# EAGLE design reefingBrd (EAGLE 9.6.2)
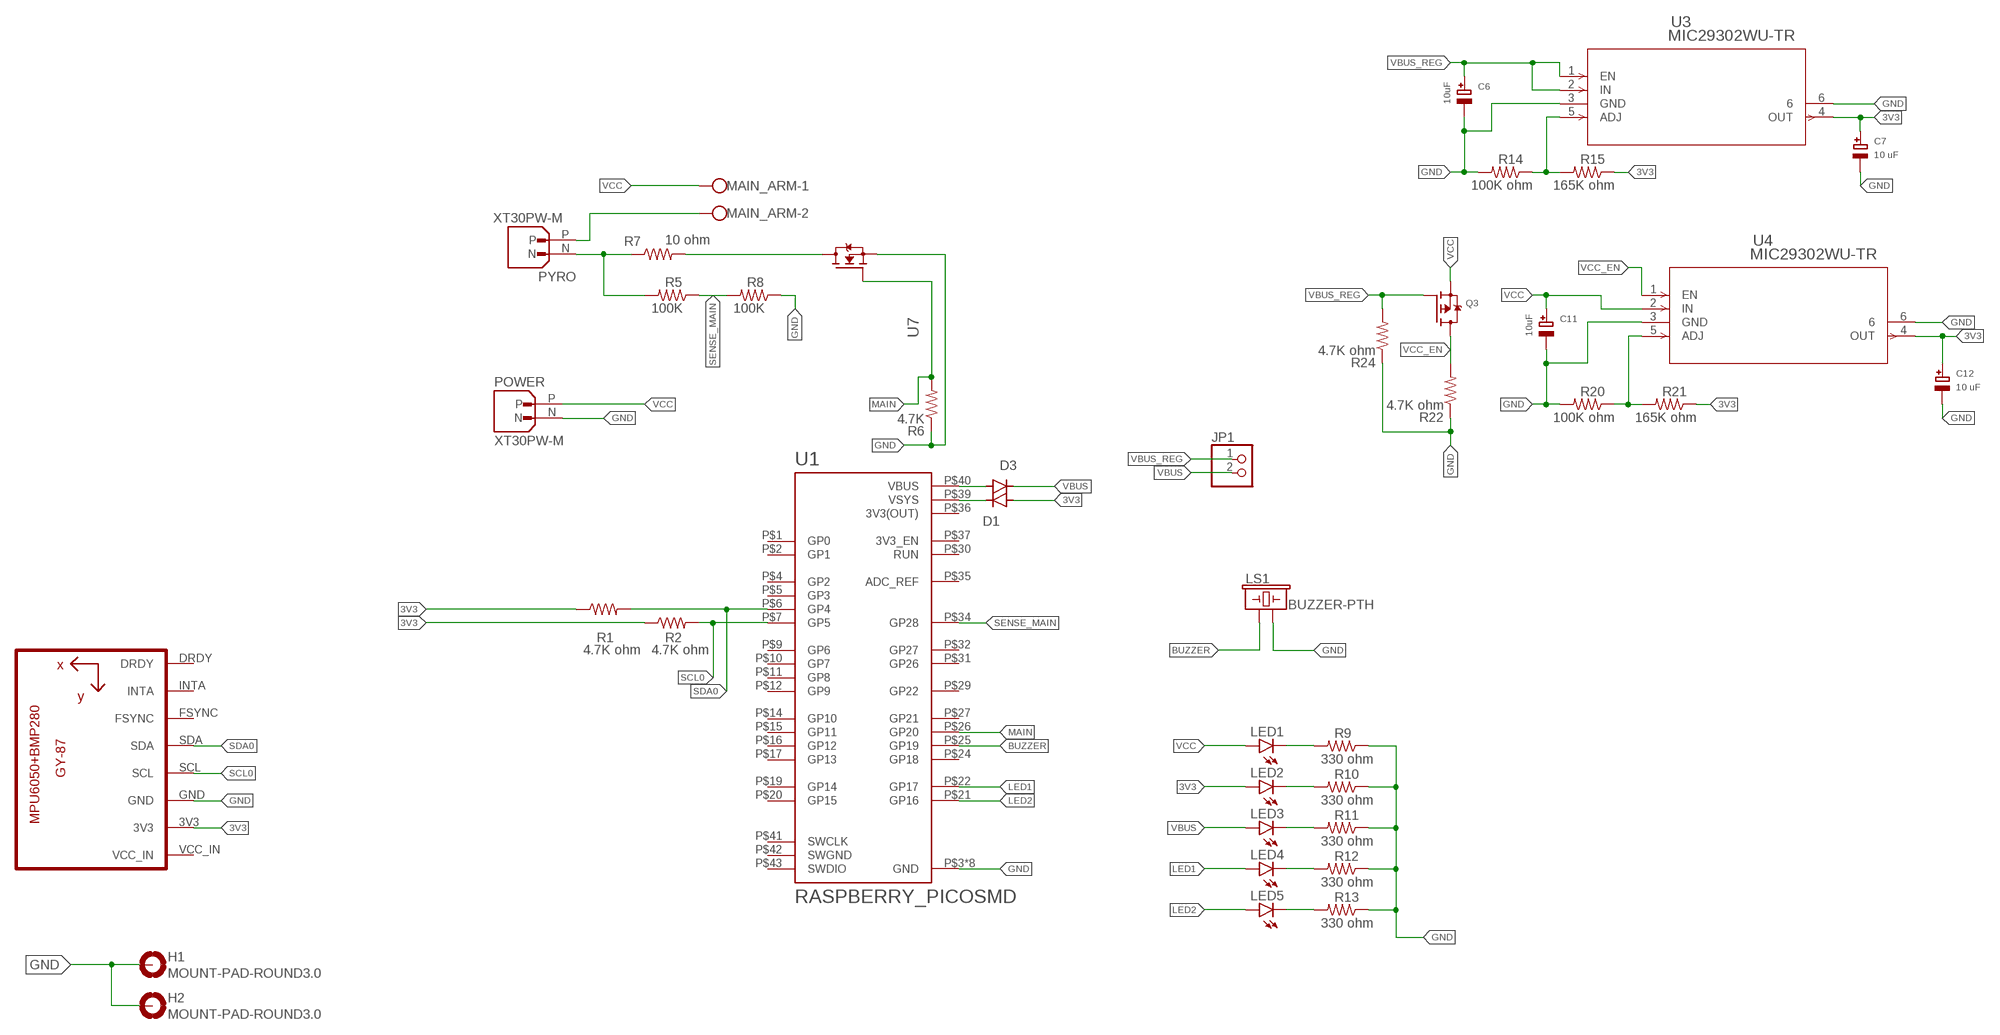
[diagram p0: schematic, sheet 1]

## Parts
C6  10uF  CAP_TANTALUMA/3216_WAVE  [EIA3216-18/A-W]
C7  10 uF  CAP_TANTALUMA/3216_WAVE  [EIA3216-18/A-W]
C11  10uF  CAP_TANTALUMA/3216_WAVE  [EIA3216-18/A-W]
C12  10 uF  CAP_TANTALUMA/3216_WAVE  [EIA3216-18/A-W]
D1  1N4004  [DO41-10]
D3  1N4004  [DO41-10]
H1  MOUNT-PAD-ROUND3.0  [3,0-PAD]
H2  MOUNT-PAD-ROUND3.0  [3,0-PAD]
JP1  PINHD-1X2  [1X02]
LED1  LEDCHIPLED_1206  [CHIPLED_1206]
LED2  LEDCHIPLED_1206  [CHIPLED_1206]
LED3  LEDCHIPLED_1206  [CHIPLED_1206]
LED4  LEDCHIPLED_1206  [CHIPLED_1206]
LED5  LEDCHIPLED_1206  [CHIPLED_1206]
LS1  BUZZER-PTH  [BUZZER-12MM]
MAIN_ARM  W237-102  [W237-102]
POWER  XT30PW-M  [AMASS_XT30PW-M]
PYRO  XT30PW-M  [AMASS_XT30PW-M]
Q3  MOSFET-PWIDE  [SOT23-WIDE]
R1  4.7K ohm  R-US_R0805  [R0805]
R2  4.7K ohm  R-US_R0805  [R0805]
R5  100K  R-US_R0805  [R0805]
R6  4.7K  R-US_R0805  [R0805]
R7  10 ohm  R-US_0207/10  [0207/10]
R8  100K  R-US_R0805  [R0805]
R9  330 ohm  R-US_R0805  [R0805]
R10  330 ohm  R-US_R0805  [R0805]
R11  330 ohm  R-US_R0805  [R0805]
R12  330 ohm  R-US_R0805  [R0805]
R13  330 ohm  R-US_R0805  [R0805]
R14  100K ohm  R-US_R0805  [R0805]
R15  165K ohm  R-US_R0805  [R0805]
R20  100K ohm  R-US_R0805  [R0805]
R21  165K ohm  R-US_R0805  [R0805]
R22  4.7K ohm  R-US_R0805  [R0805]
R24  4.7K ohm  R-US_R0805  [R0805]
U1  RASPBERRY_PICOSMD  [PICO-PKG-SMD]
U2  GY-521MPU6050  [GY-521]
U3  MIC29302WU-TR  [TO-263-5_MCH]
U4  MIC29302WU-TR  [TO-263-5_MCH]
U7  IRF540NPBF  [TO254P1054X469X1930-3]

## Nets
3V3: C7.+ C12.+ D1.A LED2.A R1.1 R2.1 R15.1 R21.1 U2.3V3 U3.4(OUT) U4.4(OUT)
BUZZER: LS1.+ U1.P$25(GP19)
GND: C6.- C7.- C11.- C12.- H1.B3,0(MOUNT) H2.B3,0(MOUNT) LS1.- POWER.N R6.1 R8.1 R9.1 R10.1 R11.1 R12.1 R13.1 R14.2 R20.2 R22.1 R24.1 U1.P$3(GND) U1.P$8(GND) U1.P$13(GND) U1.P$18(GND) U1.P$23(GND) U1.P$28(GND) U1.P$33(GND) U1.P$38(GND) U2.GND U3.3(GND) U3.6 U4.3(GND) U4.6 U7.3(S)
LED1: LED4.A U1.P$22(GP17)
LED2: LED5.A U1.P$21(GP16)
MAIN: R6.2 U1.P$26(GP20) U7.1(G)
N$1: D1.C U1.P$39(VSYS)
N$2: D3.A U1.P$40(VBUS)
N$3: R20.1 R21.2 U4.5(ADJ)
N$4: PYRO.N R5.2 R7.1
N$5: R7.2 U7.2(D)
N$6: MAIN_ARM.2 PYRO.P
N$10: R14.1 R15.2 U3.5(ADJ)
N$11: LED1.C R9.2
N$12: LED2.C R10.2
N$13: LED3.C R11.2
N$14: LED4.C R12.2
N$15: LED5.C R13.2
SCL0: R2.2 U1.P$7(GP5) U2.SCL
SDA0: R1.2 U1.P$6(GP4) U2.SDA
SENSE_MAIN: R5.1 R8.2 U1.P$34(GP28)
VBUS: D3.C JP1.2 LED3.A
VBUS_REG: C6.+ JP1.1 Q3.1(G) R24.2 U3.1(EN) U3.2(IN)
VCC: C11.+ LED1.A MAIN_ARM.1 POWER.P Q3.2(S) U4.2(IN)
VCC_EN: Q3.3(D) R22.2 U4.1(EN)
Unconnected: U1.P$1(GP0) U1.P$2(GP1) U1.P$4(GP2) U1.P$5(GP3) U1.P$9(GP6) U1.P$10(GP7) U1.P$11(GP8) U1.P$12(GP9) U1.P$14(GP10) U1.P$15(GP11) U1.P$16(GP12) U1.P$17(GP13) U1.P$19(GP14) U1.P$20(GP15) U1.P$24(GP18) U1.P$27(GP21) U1.P$29(GP22) U1.P$30(RUN) U1.P$31(GP26) U1.P$32(GP27) U1.P$35(ADC_REF) U1.P$37(3V3_EN) U1.P$41(SWCLK) U1.P$43(SWDIO) U2.DRDY U2.FSYNC U2.INTA U2.VCC_IN

## Power pins joined to a net without a drawn wire
3V3(OUT): U1.P$36(3V3(OUT))
SWGND: U1.P$42(SWGND)

## Library data of the parts
C6 C7 C11 C12 = microbuilder:CAP_TANTALUM: Tantalum Capacitors Wave footprints have larger pads and are meant to be used for hand soldering. Reflow footprints are optimised for solder paste and a reflow oven. EIA3216-18/A-[R/W] - Size A / 3216-18 / 1206 footprint 4.7µF 25V 10% Tantalum Capacitor 10µF 16V 10% Tantalum Capacitor [Digikey: 495-2236-2-ND] EIA3528-21/B-[R/W] - Size B / 3528-21 47µF 10V 10% Tantalum Capactior [Digikey: 495-2216-1-ND] EIA6032-28/C-[R/W] - Size C / 6032-28 10µF 35V 20% Tantalum Capacitor [Digikey: 495-2285-1-ND] 100µF 16V 10% Tantalum Capactior [Digikey: 399-5214-1-ND]
D1 D3 = diode:1N4004: DIODE general purpose rectifier, 1 A
H1 H2 = holes:MOUNT-PAD-ROUND: MOUNTING PAD, round
JP1 = pinhead:PINHD-1X2: PIN HEADER
LED1-LED5 = led:LED: LED OSRAM: - CHIPLED LG R971, LG N971, LY N971, LG Q971, LY Q971, LO R971, LY R971 LH N974, LH R974 LS Q976, LO Q976, LY Q976 LO Q996 - Hyper CHIPLED LW Q18S LB Q993, LB Q99A, LB R99A - SideLED LS A670, LO A670, LY A670, LG A670, LP A670 LB A673, LV A673, LT A673, LW A673 LH A674 LY A675 LS A676, LA A676, LO A676, LY A676, LW A676 LS A679, LY A679, LG A679 - Hyper Micro SIDELED® LS Y876, LA Y876, LO Y876, LY Y876 LT Y87S - SmartLED LW L88C, LW L88S LB L89C, LB L89S, LG L890 LS L89K, LO L89K, LY L89K LS L896, LA L896, LO L896, LY L896 - TOPLED LS T670, LO T670, LY T670, LG T670, LP T670 LSG T670, LSP T670, LSY T670, LOP T670, LYG T670 LG T671, LOG T671, LSG T671 LB T673, LV T673, LT T673, LW T673 LH T674 LS T676, LA T676, LO T676, LY T676, LB T676, LH T676, LSB T676, LW T676 LB T67C, LV T67C, LT T67C, LS T67K, LO T67K, LY T67K, LW E67C LS E67B, LA E67B, LO E67B, LY E67B, LB E67C, LV E67C, LT E67C LW T67C LS T679, LY T679, LG T679 LS T770, LO T770, LY T770, LG T770, LP T770 LB T773, LV T773, LT T773, LW T773 LH T774 LS E675, LA E675, LY E675, LS T675 LS T776, LA T776, LO T776, LY T776, LB T776 LHGB T686 LT T68C, LB T68C - Hyper Mini TOPLED® LB M676 - Mini TOPLED Santana® LG M470 LS M47K, LO M47K, LY M47K Source: http://www.osram.convergy.de LUXEON: - LUMILED® LXK2-PW12-R00, LXK2-PW12-S00, LXK2-PW14-U00, LXK2-PW14-V00 LXK2-PM12-R00, LXK2-PM12-S00, LXK2-PM14-U00 LXK2-PE12-Q00, LXK2-PE12-R00, LXK2-PE12-S00, LXK2-PE14-T00, LXK2-PE14-U00 LXK2-PB12-K00, LXK2-PB12-L00, LXK2-PB12-M00, LXK2-PB14-N00, LXK2-PB14-P00, LXK2-PB14-Q00 LXK2-PR12-L00, LXK2-PR12-M00, LXK2-PR14-Q00, LXK2-PR14-R00 LXK2-PD12-Q00, LXK2-PD12-R00, LXK2-PD12-S00 LXK2-PH12-R00, LXK2-PH12-S00 LXK2-PL12-P00, LXK2-PL12-Q00, LXK2-PL12-R00 Source: www.luxeon.com KINGBRIGHT: KA-3528ASYC Source: www.kingbright.com
LS1 = SparkFun-Electromechanical:BUZZER: Buzzer Small round buzzers that operate around the audible 2kHz range. You can use these as speakers to create simple music or user interfaces. Variant Overview: PTH - Mini Speaker - PC Mount 12mm 2.048kHz <https://www.sparkfun.com/products/7950> PTH_KIT - Mini Speaker - PC Mount 12mm 2.048kHz <https://www.sparkfun.com/products/7950> KIT simplifies soldering by adding stop mask to one side of the pads. PTH_NO_SILK - Mini Speaker - PC Mount 12mm 2.048kHz <https://www.sparkfun.com/products/7950> No silkscreen indicator of buzzer outline. PTH_KIT_NO_SILK - Mini Speaker - PC Mount 12mm 2.048kHz <https://www.sparkfun.com/products/7950> KIT package w/o silkscreen SMD - Buzzer Audio Magnetic (CCV-084B16) SMD buzzer used on, e.g. the LilyPad Buzzer <https://www.sparkfun.com/products/8463> and RFID USB Reader <https://www.sparkfun.com/products/9963>. SMD_KIT - Buzzer Audio Magnetic (CCV-084B16) SMD Buzzer with elongated pins to make soldering easier. Used on the SparkFun Simon Says - Surface Mount Soldering Kit <https://www.sparkfun.com/products/10935>. SMD-SQUARE - Buzzer Audio Magnetic (COMP-15701) SMT square buzzer with one chamfered corner.; PROD_ID: COMP-08253; SF_SKU: COM-07950
MAIN_ARM = con-wago-500:W237-102: WAGO SCREW CLAMP; MPN: 237-102; OC_FARNELL: unknown; OC_NEWARK: 70K9898
POWER PYRO = XT30PW-M:XT30PW-M: Check availability <https://pricing.snapeda.com/parts/XT30PW-M/AMASS/view-part?ref=eda>; AVAILABILITY: Not in stock; CHECK_PRICES: https://www.snapeda.com/parts/XT30PW-M/AMASS/view-part/?ref=eda; DESCRIPTION: Socket; DC supply; XT30; male; PIN: 2; on PCBs; THT; Colour: yellow; MF: AMASS; MP: XT30PW-M; PACKAGE: None; PRICE: None; SNAPEDA_LINK: https://www.snapeda.com/parts/XT30PW-M/AMASS/view-part/?ref=snap
Q3 = microbuilder:MOSFET-P: P-Channel Mosfet LEGEND VDS: Voltage Drain-Source ID: Drain Current RDS(ON): Drain-Source On-State Resistance VGS(TH): Gate-Source Threshold Voltage CISS: Drain-Source Input Capacitance SOT-23 Name VDS ID RDS(ON) VGS(TH) CISS Order Number IRLML5103 30V 760mA 600 mOhm -- 75pF @ 25V Digikey: IRLML5103PBFCT-ND IRLML6401 12V 4.3A 50 mOhm 950mV @ 250µA 830pF @ 10V Digikey: IRLML6401PBFTR-ND NTR0202PL 20V 400mA 800 mOhm 2.3V @ 250uA 70pF @ 5V Digikey: NTR0202PLT1GOSTR-ND NTR4101PT1G 20V 1.8A 85 mOhm 1.2V @ 250uA 675pF @ 10V Digikey: NTR4101PT1GOSCT-ND DMP2004K 20V 600mA 900 mOhm 1V @ 250uA 175pF @ 16V Digikey: DMP2004KDICT-ND PMV65XP 20V 3.9A 76 mOhm 950mV @ 1mA 725pF @ 20V Digikey: 568-2358-2-ND TO-252 Name VDS ID RDS(ON) VGS(TH) CISS Order Number AOD417 30V 25A 34 mOhm 3V @ 250µA 920pF @ 15V Digikey: 785-1106-2-ND
R1 R2 R5-R15 R20-R22 R24 = rcl:R-US_: RESISTOR, American symbol; SPICEPREFIX: R
U1 = RpiPico:RASPBERRY_PICO: Raspberry Pi Pico
U2 = gy-87:GY-521
U3 U4 = MIC29302WU:MIC29302WU-TR; COPYRIGHT: Copyright (C) 2024 Ultra Librarian. All rights reserved.; MANUFACTURER_PART_NUMBER: MIC29302WU-TR; MFR_NAME: Microchip
U7 = IRF540NPBF:IRF540NPBF: Check availability <https://pricing.snapeda.com/parts/IRF540NPBF/Infineon/view-part?ref=eda>; AVAILABILITY: In Stock; DESCRIPTION: RoHS Compliant | Low RDS(on) | Industry-leading quality | Dynamic dv/dt Rating | Fast Switching | Fully Avalanche Rated | 175C Operating Temperature; MF: Infineon; MP: IRF540NPBF; PACKAGE: TO-220 Infineon; PRICE: None; PURCHASE-URL: https://pricing.snapeda.com/search/part/IRF540NPBF/?ref=eda

## Board
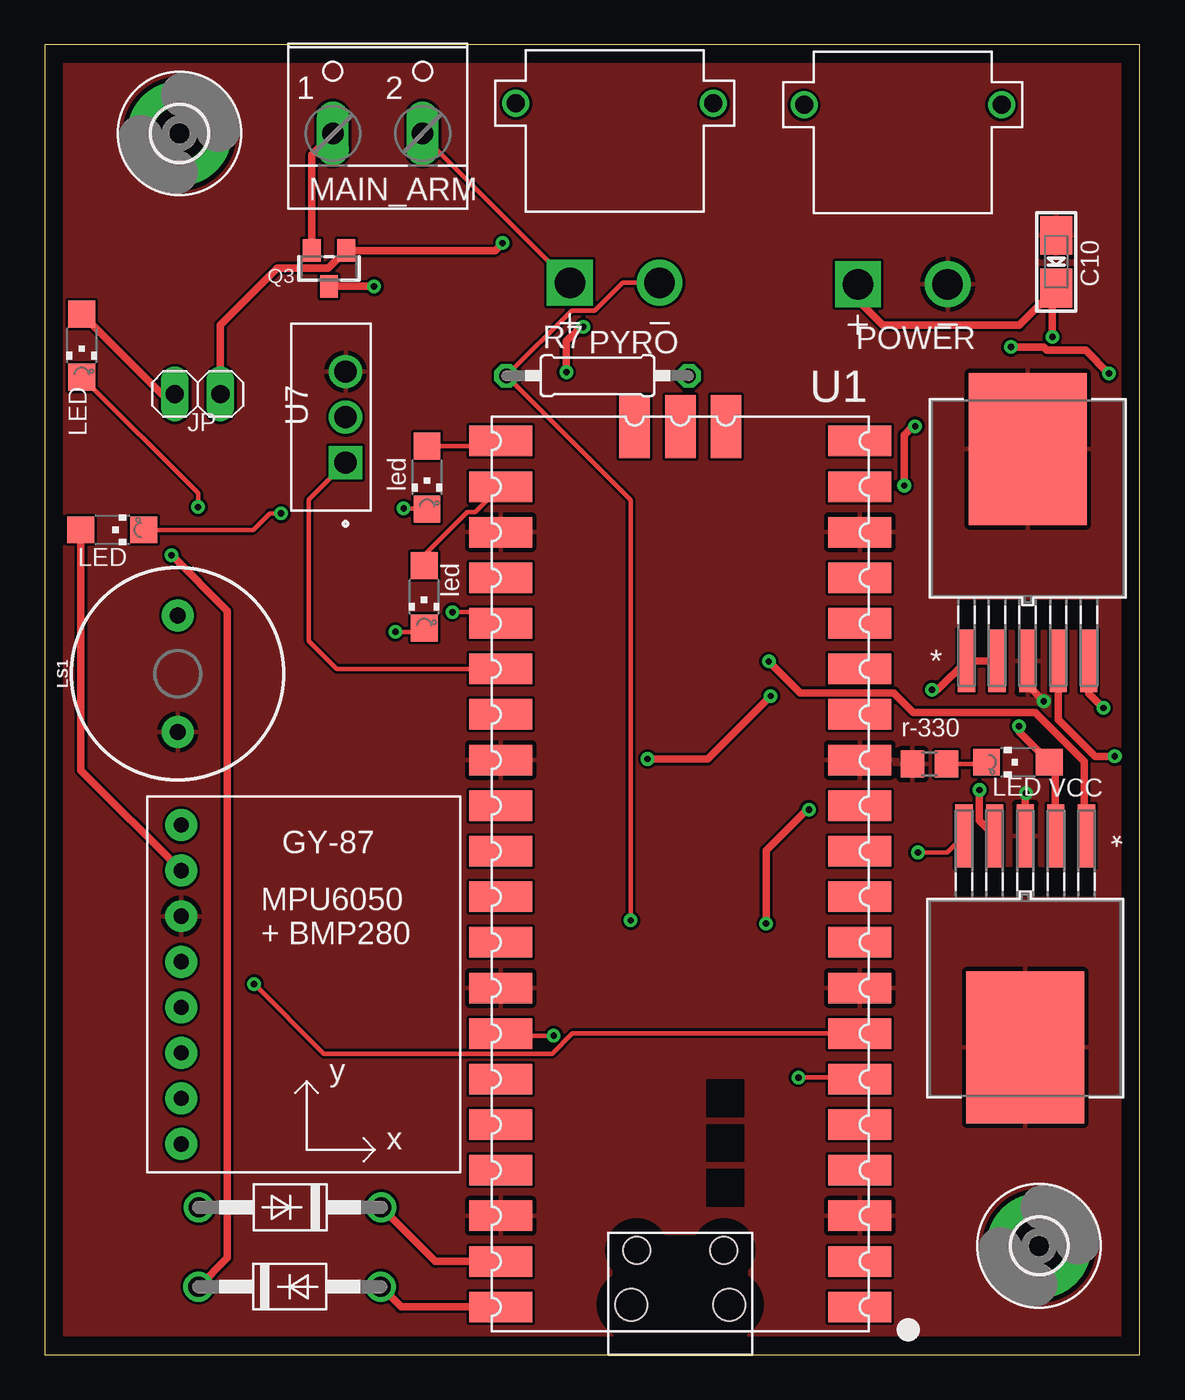
[diagram p1: board, top side]
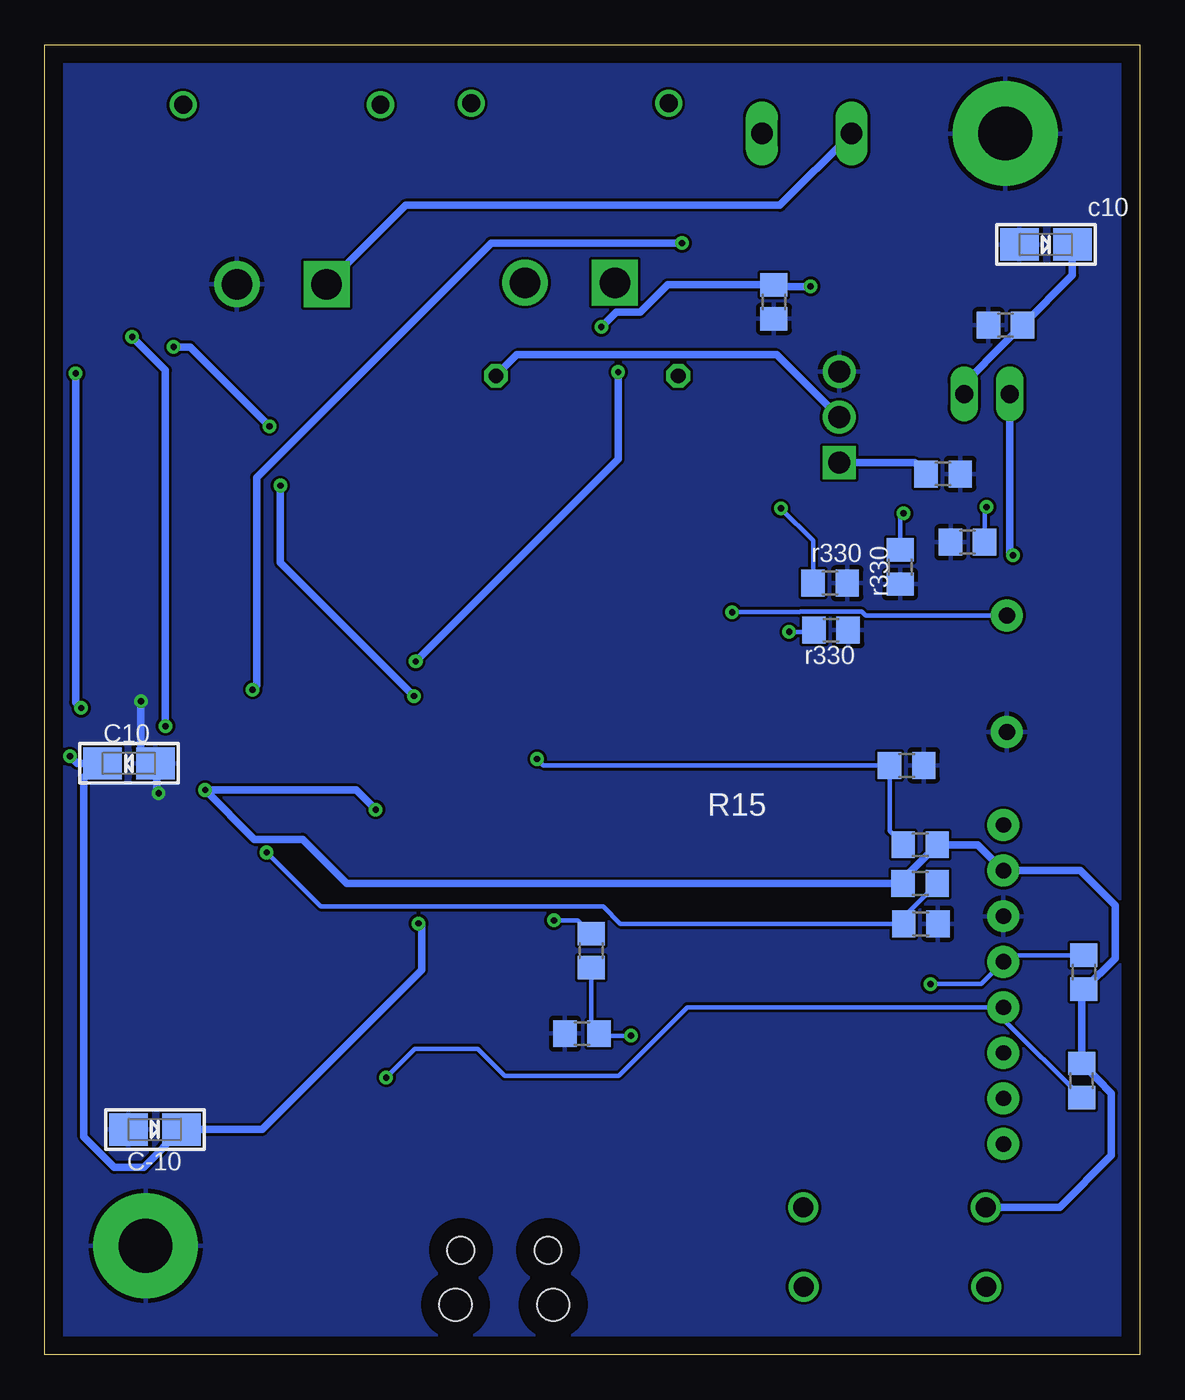
[diagram p2: board, bottom side, seen from below]

Size 61 x 73 mm. Coordinates in mm from the lower left corner, seen from the top.
Outline: 0,0 61,0 61,73 0,73 0,0
Copper layers (1*16): Top 0.035mm / dielectric 1.5mm / Bottom 0.035mm
Design rules "default": minimum track width 6mil, minimum drill 0.35mm, track to track 6mil, track to pad 6mil, pad to pad 6mil, via to via 6mil, smd to smd 6mil, copper to edge 40mil, drill to drill 6mil, minimum pad ring 10mil, minimum via ring 8mil, stop-mask expansion 4mil, vias tented up to drill 0mil, thermal gap 10mil

### Footprints (pad centres in the part's own frame; a part is rotated, then mirrored left to right if it is on the bottom)
EIA3216-18/A-W = smd 2.15 x 1.8: + 1.475,0; - -1.475,0
DO41-10 = drill 1.118: A 5.08,0; C -5.08,0
3,0-PAD = drill 3 pad 5.842: B3,0 0,0
1X02 = drill 1.016 long: 1 -1.27,0; 2 1.27,0
CHIPLED_1206 = smd 1.5 x 1.5: A 0,-1.75; C 0,1.75
BUZZER-12MM = drill 0.9 pad 1.778: + 3.25,0; - -3.25,0
W237-102 = drill 1.194 long: 1 -2.5,-1.27; 2 2.5,-1.27
AMASS_XT30PW-M = drill 1.7: N 2.5,-10 | drill 1.7 square: P -2.5,-10 | drill 1: S1 5.5,0; S2 -5.5,0
SOT23-WIDE = smd 1 x 1.27: 1 -0.95,-1; 2 0.95,-1; 3 0,1
R0805 = smd 1.3 x 1.5: 1 -0.95,0; 2 0.95,0
0207/10 = drill 0.813 octagon: 1 -5.08,0; 2 5.08,0
PICO-PKG-SMD = smd 3.5 x 1.7: P$1 -10,24.13; P$2 -10,21.59; P$3 -10,19.05; P$4 -10,16.51; P$5 -10,13.97; P$6 -10,11.43; P$7 -10,8.89; P$8 -10,6.35; P$9 -10,3.81; P$10 -10,1.27; P$11 -10,-1.27; P$12 -10,-3.81; P$13 -10,-6.35; P$14 -10,-8.89; P$15 -10,-11.43; P$16 -10,-13.97; P$17 -10,-16.51; P$18 -10,-19.05; P$19 -10,-21.59; P$20 -10,-24.13; P$21 10,-24.13; P$22 10,-21.59; P$23 10,-19.05; P$24 10,-16.51; P$25 10,-13.97; P$26 10,-11.43; P$27 10,-8.89; P$28 10,-6.35; P$29 10,-3.81; P$30 10,-1.27; P$31 10,1.27; P$32 10,3.81; P$33 10,6.35; P$34 10,8.89; P$35 10,11.43; P$36 10,13.97; P$37 10,16.51; P$38 10,19.05; P$39 10,21.59; P$40 10,24.13 | smd 1.7 x 3.5: P$41 -2.54,-24.925; P$42 0,-24.925; P$43 2.54,-24.925 | hole 1.8: -2.725,24; 2.725,24 | hole 1.5: -2.425,20.97; 2.425,20.97
GY-521 = drill 0.85 pad 1.778: 3V3 1.905,16.828; DRDY 1.905,1.587; FSYNC 1.905,6.668; GND 1.905,14.287; INTA 1.905,4.128; SCL 1.905,11.748; SDA 1.905,9.207; VCC_IN 1.905,19.367
TO-263-5_MCH = smd 0.965 x 3.505: 1 -3.404,-9.055; 2 -1.702,-9.055; 3 0,-9.055; 4 1.702,-9.055; 5 3.404,-9.055 | smd 6.553 x 8.458: 6 0,2.743
TO254P1054X469X1930-3 = drill 1.23 square: 1 -2.54,-0.81 | drill 1.23: 2 0,-0.81; 3 2.54,-0.81

### Placement (x,y rotation side)
C6  5.23,61.87 0 bottom
C7  54.87,12.55 0 bottom
C11  56.35,60.91 270 top
C12  56.32,32.95 180 bottom
D1  13.66,8.21 180 top
D3  13.64,3.79 0 top
H1  55.39,6.06 0 top
H2  7.5,68.06 0 top
JP1  8.51,53.54 180 top
LED1  54.21,33.02 90 top
LED2  3.76,45.97 270 top
LED3  2.05,56.24 180 top
LED4  21.13,42.24 180 top
LED5  21.29,48.89 180 top
LS1  7.4,37.95 90 top
MAIN_ARM  18.55,69.33 0 top
POWER  47.8,69.66 0 top
PYRO  31.75,69.75 0 top
Q3  15.83,60.54 180 top
R1  3.24,15.28 270 bottom
R2  3.11,21.31 90 bottom
R5  30.56,22.52 90 bottom
R6  10.95,49.09 180 bottom
R7  30.79,54.55 0 top
R8  31.07,17.89 0 bottom
R9  49.29,32.92 0 top
R10  13.35,43.9 90 bottom
R11  9.59,45.28 0 bottom
R12  17.2,40.38 180 bottom
R13  17.25,43 180 bottom
R14  12.99,32.84 0 bottom
R15  12.23,28.42 180 bottom
R20  12.2,24.01 0 bottom
R21  12.23,26.27 0 bottom
R22  20.38,58.68 90 bottom
R24  7.48,57.38 0 bottom
U1  35.4,26.79 180 top
U2  5.69,10.15 0 top
U3  54.76,47.73 0 top
U4  54.62,19.86 180 top
U7  15.94,52.25 90 top

### Tracks (layer width: path | path; a pad name or v marks a point on that pad's centre or on a via)
3V3  (via drill 0.35)
  Top 0.406: v59.61,33.35 58.51,33.35 56.46,35.4 U3.4 | LED2.A 2.01,32.56 U2.3V3 | U4.4 52.07,29.77 v52.07,31.47 | v40.18,24.03 40.18,28.09 42.47,30.38 v42.57,30.38
  Bottom 0.406: C12.+ 58.04,32.95 | 58.04,32.95 59.21,32.95 v59.61,33.35 | 58.04,32.95 58.83,32.16 58.83,12.14 57.12,10.44 55.51,10.44 C7.+ 48.9,12.55 40.01,21.44 40.01,23.85 v40.18,24.03 | D1.A 4.46,8.21 1.57,11.1 1.57,14.57 2.34,15.34 2.35,15.34 R1.1 3.24,20.23 R2.1 2.22,21.26 2.21,21.26 1.37,22.1 1.37,25.04 3.31,26.98 U2.3V3 9.04,28.42 R15.1 12.17,27.53 12.17,27.52 13.18,26.52 R21.1 44.18,26.27 46.63,28.73 49.32,28.73 v52.07,31.47 43.66,31.47 v42.57,30.38
BUZZER  (via drill 0.35)
  Top 0.254: v22.71,41.38 24.78,41.38 U1.P$25
  Bottom 0.254: LS1.+ 15.28,41.2 15.48,41.41 18.91,41.41 18.95,41.38 v22.71,41.38
GND  (via drill 0.35)
  Top 0.406: U4.3 54.62,31.25 v54.66,31.29 | U3.3 54.76,37.32 v55.65,36.42
  Bottom 0.406: v54.66,31.29 54.77,31.41 54.77,32.88 C12.- 55.65,33.76 v55.65,36.42
  pour Bottom: 0,73 0,0.03 0.03,0 60.99,0 61.01,0.03 61.01,72.95 60.99,72.97 60.96,73
  pour Top: 0,73.03 0,0.03 0.05,-0.03 60.91,-0.03 61.01,0.08 61.01,72.97 60.96,73.03
LED1
  Top 0.254: U1.P$22 23.99,46.97 23.53,46.97 21.13,44.56 LED4.A
LED2
  Top 0.254: LED5.A 25.12,50.64 U1.P$21
MAIN
  Top 0.254: U1.P$26 16.26,38.22 14.71,39.78 14.71,47.67 U7.1
  Bottom 0.406: R6.2 12.53,49.71 U7.1
N$1
  Top 0.406: U1.P$39 21.75,5.2 D1.C
N$2
  Top 0.406: U1.P$40 19.85,2.66 D3.A
N$3  (via drill 0.35)
  Top 0.254: U4.5 50.29,27.99 v48.64,27.99
  Bottom 0.254: v48.64,27.99 45.64,24.99 29.9,24.99 28.93,24.01 R20.1 13.15,24.4 R21.2
N$4  (via drill 0.35)
  Top 0.254: PYRO.N 32.19,59.75 30.64,58.19 29.35,58.19 R7.1 32.64,47.63 v32.64,24.21
  Bottom 0.254: R5.2 31.3,24.21 v32.64,24.21
N$5
  Bottom 0.406: U7.2 20.23,55.73 34.7,55.73 R7.2
N$6
  Top 0.254: MAIN_ARM.2 21.05,67.94 PYRO.P
N$10  (via drill 0.35)
  Top 0.406: v33.58,33.2 36.93,33.2 v40.44,36.7 | v47.88,48.44 47.88,51.26 48.36,51.74 v48.49,51.74 | v53.82,56.16 55.66,56.16 55.83,55.98 57.98,55.98 v59.28,54.69 | v58.98,36.04 58.16,36.86 U3.5
  Bottom 0.254: R15.2 13.94,29.18 R14.1 33.22,32.84 v33.58,33.2
  Bottom 0.406: v40.44,36.7 47.88,44.15 v47.88,48.44 | v48.49,51.74 52.91,56.16 v53.82,56.16 | v59.28,54.69 59.28,36.35 v58.98,36.04
N$11
  Top 0.254: R9.2 52.36,32.92 LED1.C
N$12  (via drill 0.35)
  Top 0.254: LED2.C 11.61,45.97 12.53,46.89 v13.16,46.89
  Bottom 0.254: v13.16,46.89 13.35,46.7 R10.2
N$13  (via drill 0.35)
  Top 0.254: LED3.C 8.53,48.01 v8.53,47.24
  Bottom 0.254: v8.53,47.24 8.64,47.14 R11.2
N$14  (via drill 0.35)
  Top 0.254: LED4.C 20.92,40.28 v19.53,40.28
  Bottom 0.254: v19.53,40.28 18.24,40.28 R12.2
N$15  (via drill 0.35)
  Top 0.254: v19.99,47.17 21.26,47.17 LED5.C
  Bottom 0.254: R13.2 18.2,45.38 v19.99,47.17
SCL0  (via drill 0.35)
  Top 0.254: U1.P$7 29.4,17.9 28.27,16.77 15.54,16.77 v11.66,20.65
  Bottom 0.254: R2.2 7.23,22.26 U2.SCL 8.84,20.65 v11.66,20.65
SDA0  (via drill 0.35)
  Top 0.254: v41.99,15.44 45.32,15.44 U1.P$6
  Bottom 0.254: R1.2 7.59,18.68 U2.SDA 25.22,19.36 29.03,15.54 35.38,15.54 36.88,17.04 40.39,17.04 v41.99,15.44
SENSE_MAIN  (via drill 0.35)
  Top 0.254: U1.P$34 25.52,17.78 v28.35,17.78
  Bottom 0.254: R5.1 30.56,18.33 R8.2 30.01,17.78 v28.35,17.78
VBUS  (via drill 0.35)
  Top 0.406: LED3.A 6.5,53.54 JP1.2 | D3.C 10.16,5.39 10.16,41.45 v7.06,44.55
  Bottom 0.406: v7.06,44.55 7.24,44.73 JP1.2
VBUS_REG  (via drill 0.35)
  Top 0.406: JP1.1 9.78,57.38 12.95,60.55 14.23,60.55 15.79,60.55 Q3.1 25.09,61.54 v25.5,61.95 | v49.43,37.06 49.74,37.06 U3.1 U3.2
  Bottom 0.406: JP1.1 9.78,54.13 7.42,56.48 7.42,56.49 R24.2 3.76,60.15 C6.+ | v25.5,61.95 36.14,61.95 49.2,48.9 49.2,37.29 v49.43,37.06
VCC  (via drill 0.35)
  Top 0.406: U4.2 56.29,28.96 56.29,32.69 LED1.A 54.28,34.7 v54.28,35.03 | Q3.2 14.88,66.89 MAIN_ARM.1 | POWER.P 45.3,58.76 46.69,57.38 54.29,57.38 C11.+ 56.13,59.23 v56.13,56.72
  Bottom 0.406: MAIN_ARM.1 20.05,64.06 40.9,64.06 POWER.P | v54.28,35.03 54.28,54.86 v56.13,56.72
VCC_EN  (via drill 0.35)
  Top 0.406: Q3.3 v18.34,59.54 | U4.1 57.91,29.03 57.91,33.07 55.19,35.79 48.39,35.79 47.3,36.89 42.08,36.89 v40.34,38.63 | v29.06,54.76 29.06,56.49 29.84,57.28 v30,57.28
  Bottom 0.406: v18.34,59.54 20.29,59.54 R22.2 26.31,59.63 27.82,58.12 29.16,58.12 v30,57.28 | v40.34,38.63 29.06,49.91 v29.06,54.76

### Text on the board
tPlace: C10 | LED | JP | led | LED | led | LED | VCC
bPlace: c10 | r330 | r330 | r330 | C10
tNames: r-330
bNames: C-10